# EAGLE design wifilamp (EAGLE 7.7.0)
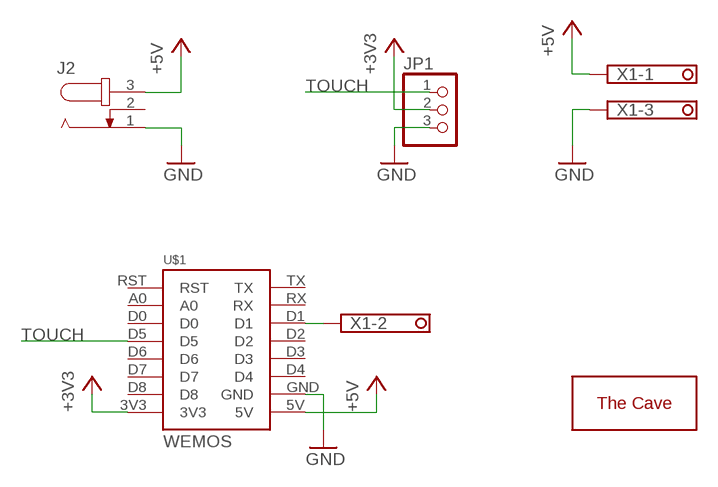
[diagram p0: schematic, sheet 1]

## Parts
J2  PC-GK210  [PC-GK21]
JP1  PINHD-1X3  [1X03]
U$1  WEMOS  [WEMOS]
U$2  THECAVE_LOGO_COPPER_SMALL  [COPPER_SMALL]
X1  1751251  [1751251]

## Nets
+3V3: JP1.2 U$1.3V3
+5V: J2.3 U$1.5V X1.1
GND: J2.1 JP1.3 U$1.GND X1.3
N$2: U$1.D1 X1.2
TOUCH: JP1.1 U$1.D5
Unconnected: J2.2 U$1.A0 U$1.D0 U$1.D2 U$1.D3 U$1.D4 U$1.D6 U$1.D7 U$1.D8 U$1.RST U$1.RX U$1.TX

## Library data of the parts
J2 = con-jack-pc-gk21:PC-GK21: DC POWER JACK PC-GK2.1 (806-312) <https://www.gme.cz/napajeci-souosy-konektor-pc-gk2-1>
JP1 = pinhead:PINHD-1X3: PIN HEADER
U$1 = d1-mini:WEMOS
U$2 = thecave:THECAVE_LOGO: The Cave DIY workshop logos thecave.cz
X1 = con-phoenix-350:1751251: MKDS 1/ 3-3,5 Printklemme Nennstrom: 10 A Bemessungsspannung: 160 V Raster: 3,5 mm Polzahl: 3 Montageart: Löten Anschlussart: Schraubanschluss Anschlussrichtung vom Leiter zur Platine: 0° Source: http://eshop.phoenixcontact.com .. 1751251.pdf; OC_FARNELL: unknown; OC_NEWARK: unknown

## Board
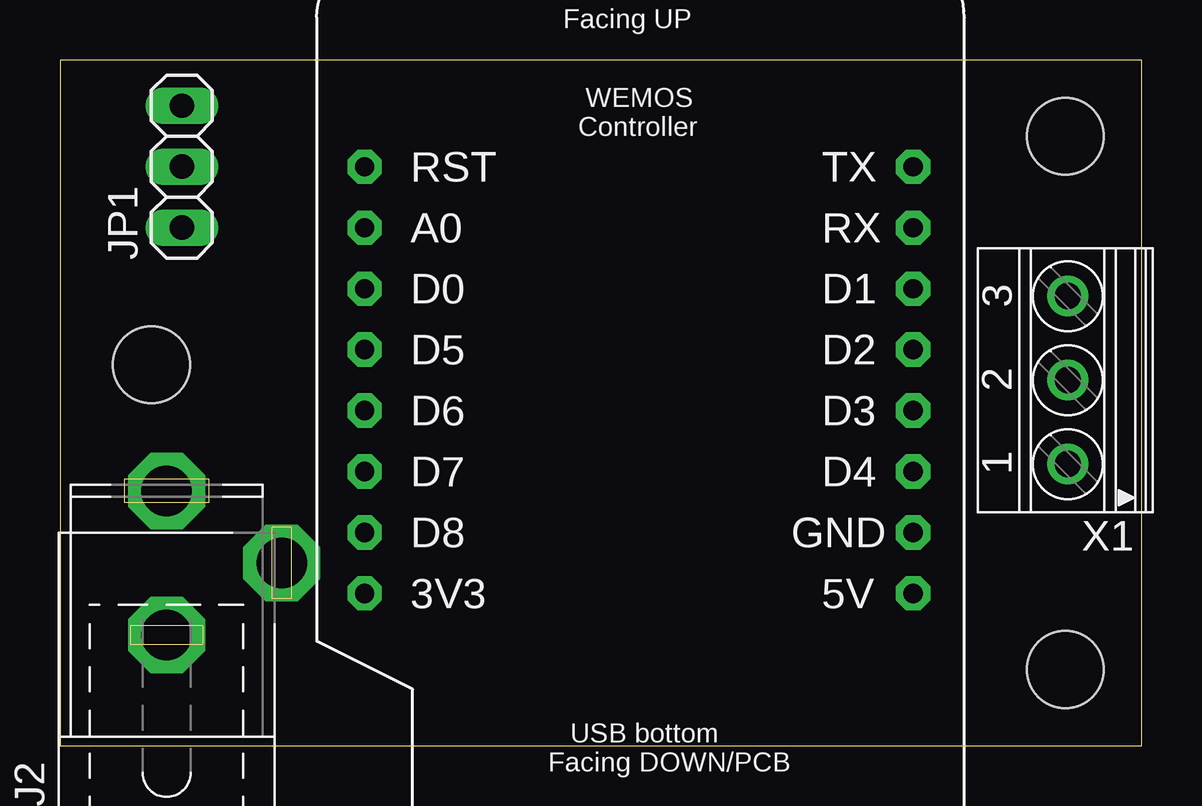
[diagram p1: board, top side]
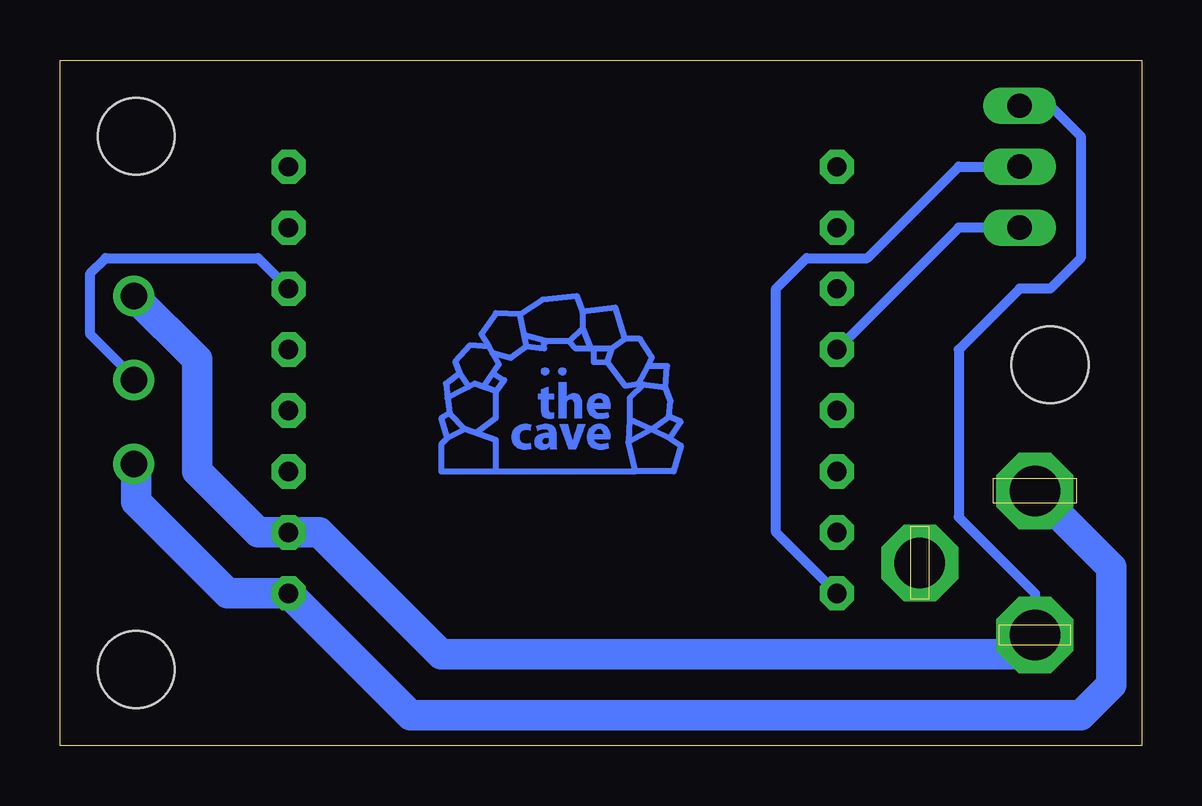
[diagram p2: board, bottom side, seen from below]

Size 45.09 x 28.57 mm. Coordinates in mm from the lower left corner, seen from the top.
Outline: 0,0 45.09,0 45.09,28.57 0,28.57 0,0
Copper layers (1*16): Top 0.035mm / dielectric 1.5mm / Bottom 0.035mm
Design rules "default": minimum track width 10mil, minimum drill 24mil, track to track 10mil, track to pad 10mil, pad to pad 10mil, via to via 10mil, smd to smd 10mil, copper to edge 24mil, drill to drill 16mil, minimum pad ring 10mil, minimum via ring 8mil, stop-mask expansion 4mil, vias tented up to drill 0mil, thermal gap 10mil
Holes 3.2 mm at 41.91,25.4 41.91,3.17 3.81,15.88

### Footprints (pad centres in the part's own frame; a part is rotated, then mirrored left to right if it is on the bottom)
PC-GK21 = drill 2.1 pad 3.2 octagon: 1 -3,0; 2 0,-4.8; 3 3,0
1X03 = drill 1.016 long: 1 -2.54,0; 2 0,0; 3 2.54,0
WEMOS = drill 0.8 pad 1.422 octagon: 3V3 0,0; 5V 22.86,0; A0 0,15.24; D0 0,12.7; D1 22.86,12.7; D2 22.86,10.16; D3 22.86,7.62; D4 22.86,5.08; D5 0,10.16; D6 0,7.62; D7 0,5.08; D8 0,2.54; GND 22.86,2.54; RST 0,17.78; RX 22.86,15.24; TX 22.86,17.78
1751251 = drill 1.1 pad 1.7: 1 -3.5,-0.1; 2 0,-0.1; 3 3.5,-0.1

### Placement (x,y rotation side)
J2  4.45,7.62 90 top
JP1  5.08,24.13 90 top
U$1  12.7,6.35 0 top
U$2  29.21,11.43 0 bottom
X1  41.91,15.24 90 top

### Tracks (layer width: path | path; a pad name or v marks a point on that pad's centre or on a via)
+3V3
  Bottom 0.406: U$1.3V3 15.24,8.89 15.24,19.05 13.97,20.32 11.43,20.32 7.62,24.13 JP1.2
+5V
  Bottom 1.27: J2.3 1.27,7.45 1.27,2.54 2.54,1.27 30.48,1.27 U$1.5V 38.1,6.35 41.91,10.16 41.91,11.64 X1.1
GND
  Bottom 0.406: JP1.3 3.81,26.67 2.54,25.4 2.54,20.32 3.81,19.05 5.08,19.05 7.62,16.51 7.62,9.53 4.45,6.35 J2.1
  Bottom 1.27: J2.1 5.25,3.81 29.21,3.81 34.29,8.89 U$1.GND 36.83,8.89 39.37,11.43 39.37,16.1 X1.3
N$2
  Bottom 0.406: X1.2 42.01,15.34 43.81,17.14 43.81,19.68 43.18,20.32 36.83,20.32 U$1.D1
TOUCH
  Bottom 0.406: JP1.1 7.62,21.59 U$1.D5